# Altium project PCB_Project.PrjPcb (part 3 of 4)

## Sheet Micro.SchDoc
size A4; SheetNumber: 3; SheetTotal: 4
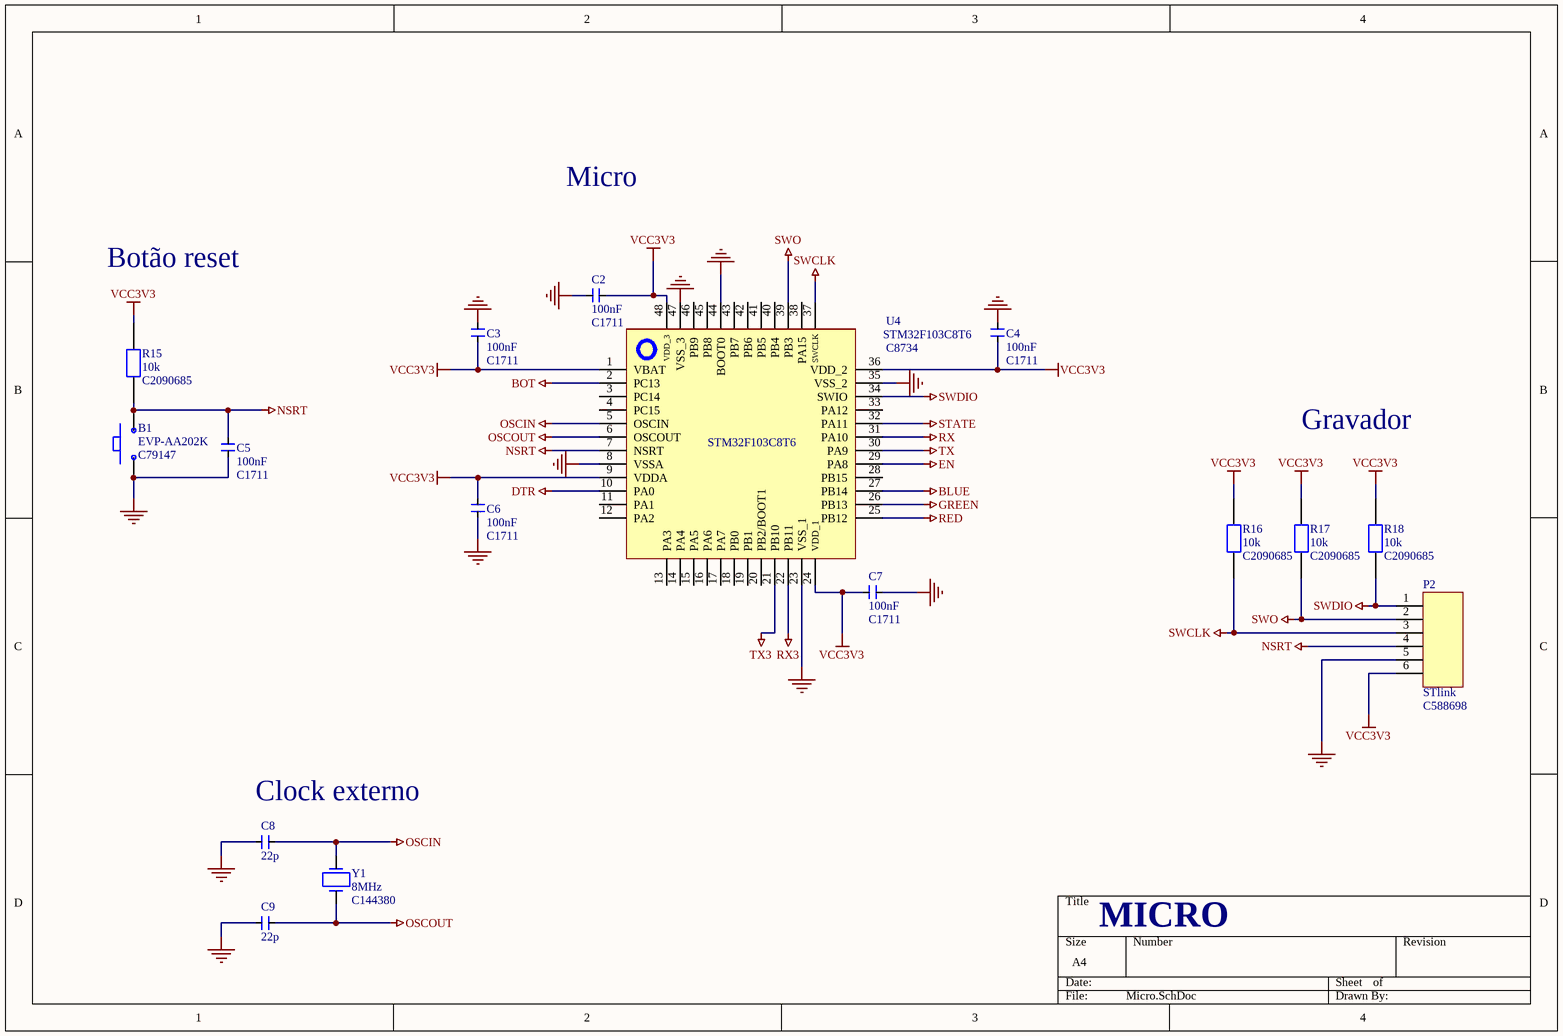
[diagram p2: Micro.SchDoc]

### Parts
B1  EVP-AA202K  LCSC: C79147  [botão]
C2  100nF  LCSC: C1711  [0805_samsung]
C3  100nF  LCSC: C1711  [0805_samsung]
C4  100nF  LCSC: C1711  [0805_samsung]
C5  100nF  LCSC: C1711  [0805_samsung]
C6  100nF  LCSC: C1711  [0805_samsung]
C7  100nF  LCSC: C1711  [0805_samsung]
C8  22p  [22p]
C9  22p  [22p]
P2  STlink  LCSC: C588698  [conector6pinos2linhas]
R15  10k  LCSC: C2090685  [10kResistor]
R16  10k  LCSC: C2090685  [10kResistor]
R17  10k  LCSC: C2090685  [10kResistor]
R18  10k  LCSC: C2090685  [10kResistor]
U4  STM32F103C8T6  LCSC: C8734  [STM32F103C8T6]
Y1  8MHz  LCSC: C144380  [cristal]

### Nets
BLUE: U4.27(PB14)
BOT: U4.2(PC13)
DTR: U4.10(PA0)
EN: U4.29(PA8)
GND: B1.3 C2.1 C3.1 C4.1 C5.2 C6.2 C7.2 C8.1 C9.1 P2.5 U4.8(VSSA) U4.23(VSS_1) U4.35(VSS_2) U4.44(BOOT0) U4.47(VSS_3)
GREEN: U4.26(PB13)
NSRT: B1.1 C5.1 P2.4 R15.1 U4.7(NSRT)
OSCIN: C8.2 U4.5(OSCIN) Y1.1
OSCOUT: C9.2 U4.6(OSCOUT) Y1.2
RED: U4.25(PB12)
RX: U4.31(PA10)
RX3: U4.22(PB11)
STATE: U4.32(PA11)
SWCLK: P2.3 R16.2 U4.37(SWCLK)
SWDIO: P2.1 R18.2 U4.34(SWIO)
SWO: P2.2 R17.2 U4.39(PB3)
TX: U4.30(PA9)
TX3: U4.21(PB10)
VCC3V3: C2.2 C3.2 C4.2 C6.1 C7.1 P2.6 R15.2 R16.1 R17.1 R18.1 U4.1(VBAT) U4.9(VDDA) U4.24(VDD_1) U4.36(VDD_2) U4.48(VDD_3)

Not connected (* = marked no-connect by the designer): U4 3(PC14) 4(PC15) 11(PA1) 12(PA2) 13(PA3) 14(PA4) 15(PA5) 16(PA6) 17(PA7) 18(PB0) 19(PB1) 20(PB2/BOOT1) 28(PB15) 33(PA12) 38(PA15) 40(PB4) 41(PB5) 42(PB6) 43(PB7) 45(PB8) 46(PB9)

### Notes on the sheet
- Micro
- Botão reset
- Gravador
- (near C8) Clock externo
- MICRO

### Library data of the parts
B1 = EVP-AA202K: Switch Tactile N.O. SPST Rectangular Button J-Bend 0.02A 15VDC 1.6N SMD Embossed T/R; Manufacturer: Panasonic; Actuator Length: 300µm; Contact Current Rating: 20mA; Contact Resistance: 100mΩ; Current Rating: 50mA; Electrical Life: 200kcycles; Illumination Type: Illuminated, Non-Illuminated; Max Voltage Rating (DC): 15V; Number of Positions: 1; Switch Function: Off-Mom; Switch Travel: 150µm; Supplier: DigiKey; Supplier Part Number: P13348SCT-ND; Manufacturer Part Number: EVP-AA202K; RoHS: Compliant; Category: Tactile Switches; Stock: 45; Pricing: 1=0,83, 10=0,709, 25=0,6596, 100=0,5885, 250=0,54516, 500=0,51492, 1000=0,48712, 2500=0,45429 (USD); Case/Package: SMD/SMT; Color: Black; Contact Plating: Gold, Silver; Depth: 2.9mm; Height: 1.4mm; Insulation Resistance: 100MΩ; Lead Free: Lead Free; Length: 4.3mm; Lifecycle Status: Production; Max Current Rating: 20mA; Max Operating Temperature: 85°C; Mechanical Life: 200kcycles; Min Operating Temperature: -40°C; Mounting Technology: Surface Mount; Operating Force: 1.6N; Radiation Hardening: No; REACH SVHC: Yes; Termination: J-Bend; Throw Configuration: SPST; Voltage Rating (DC): 15V; ComponentLink1URL: https://datasheet.octopart.com:443/EVP-AA202K-Panasonic-datasheet-156880147.pdf?src-supplier=Newark; ComponentLink1Description: https://datasheet.octopart.com:443/EVP-AA202K-Panasonic-datasheet-156880147.pdf?src-supplier=Newark; ComponentLink2URL: https://datasheet.octopart.com:443/EVP-AA202K-Panasonic-datasheet-78834739.pdf?src-supplier=Newark; ComponentLink2Description: https://datasheet.octopart.com:443/EVP-AA202K-Panasonic-datasheet-78834739.pdf?src-supplier=Newark; ComponentLink3URL: https://datasheet.octopart.com:443/EVP-AA202K-Panasonic-datasheet-13050113.pdf?src-supplier=Upverter; ComponentLink3Description: https://datasheet.octopart.com:443/EVP-AA202K-Panasonic-datasheet-13050113.pdf?src-supplier=Upverter; ComponentLink4URL: https://datasheet.octopart.com:443/EVP-AA202K-Panasonic-datasheet-138897654.pdf?src-supplier=Master+Electronics; ComponentLink4Description: https://datasheet.octopart.com:443/EVP-AA202K-Panasonic-datasheet-138897654.pdf?src-supplier=Master+Electronics; ComponentLink5URL: https://datasheet.octopart.com:443/EVPAA202K-Panasonic-datasheet-130260647.pdf?src-supplier=TME; ComponentLink5Description: https://datasheet.octopart.com:443/EVPAA202K-Panasonic-datasheet-130260647.pdf?src-supplier=TME; ComponentLink6URL: https://datasheet.octopart.com:443/EVP-AA202K-Panasonic-datasheet-94103455.pdf?src-supplier=Future+Electronics; ComponentLink6Description: https://datasheet.octopart.com:443/EVP-AA202K-Panasonic-datasheet-94103455.pdf?src-supplier=Future+Electronics; ComponentLink7URL: https://datasheet.octopart.com:443/EVP-AA202K-Panasonic-datasheet-84052654.pdf?src-supplier=Future+Electronics; ComponentLink7Description: https://datasheet.octopart.com:443/EVP-AA202K-Panasonic-datasheet-84052654.pdf?src-supplier=Future+Electronics; ComponentLink8URL: https://datasheet.octopart.com:443/EVP-AA202K-Panasonic-datasheet-62282203.pdf?src-supplier=Electro+Sonic; ComponentLink8Description: https://datasheet.octopart.com:443/EVP-AA202K-Panasonic-datasheet-62282203.pdf?src-supplier=Electro+Sonic; ComponentLink9URL: https://datasheet.octopart.com:443/EVPAA202K-Panasonic-datasheet-10854221.pdf?src-supplier=Farnell; ComponentLink9Description: https://datasheet.octopart.com:443/EVPAA202K-Panasonic-datasheet-10854221.pdf?src-supplier=Farnell; ComponentLink10URL: https://datasheet.octopart.com:443/EVP-AA202K-Panasonic-datasheet-124616.pdf?src-supplier=DigiKey; ComponentLink10Description: https://datasheet.octopart.com:443/EVP-AA202K-Panasonic-datasheet-124616.pdf?src-supplier=DigiKey
C2-C7 = CL21B104KBCNNNC: Ceramic Capacitor, Multilayer, Ceramic, 50V, 10% +Tol, 10% -Tol, X7R, +-15% TC, 100nF, Surface Mount, 0805 inch; Manufacturer: Samsung Electro-Mechanics; Supplier 1: Avnet; Supplier Part Number 1: CL21B104KBCNNNC; Manufacturer Part Number: CL21B104KBCNNNC; RoHS: Compliant; Category: Ceramic Capacitors; Stock 1: 2653700; Pricing 1: 4000=0,0047, 8000=0,00468, 16000=0,00466, 32000=0,00463, 64000=0,00461 (USD); Capacitance: 100nF; Case/Package: 0805; Case Code (Imperial): 0805; Case Code (Metric): 2012; China RoHS: Compliant; Contact Plating: Tin; Depth: 1.25mm; Dielectric: X7R; Dielectric Material: Ceramic; Height: 950µm; Lead Free: Lead Free; Length: 2mm; Lifecycle Status: Production; Material: Ceramic; Max Operating Temperature: 125°C; Min Operating Temperature: -55°C; Mount: Surface Mount; Number of Terminals: 2; Radiation Hardening: No; REACH SVHC: Yes; Schedule B: 8532240020, 8532240020|8532240020, 8532240020|8532240020|8532240020, 8532240020|8532240020|8532240020|8532240020; Thickness: 939.8µm; Tolerance: 10%; Voltage: 50V; Voltage Rating: 50V; Voltage Rating (DC): 50V; Width: 1.25mm; ComponentLink1URL: https://datasheet.octopart.com:443/CL21B104KBCNNNC-Samsung-Electro-Mechanics-datasheet-137745078.pdf?src-supplier=IHS; ComponentLink1Description: https://datasheet.octopart.com:443/CL21B104KBCNNNC-Samsung-Electro-Mechanics-datasheet-137745078.pdf?src-supplier=IHS; ComponentLink2URL: https://datasheet.octopart.com/CL21B104KBCNNNC-Samsung-Electro-Mechanics-datasheet-8324245.pdf; ComponentLink2Description: https://datasheet.octopart.com/CL21B104KBCNNNC-Samsung-Electro-Mechanics-datasheet-8324245.pdf; ComponentLink3URL: https://datasheet.octopart.com/CL21B104KBCNNNC-Samsung-Electro-Mechanics-datasheet-97040617.pdf; ComponentLink3Description: https://datasheet.octopart.com/CL21B104KBCNNNC-Samsung-Electro-Mechanics-datasheet-97040617.pdf; ComponentLink4URL: https://datasheet.octopart.com:443/CL21B104KBCNNNC-Samsung-Electro-Mechanics-datasheet-11548950.pdf?src-supplier=Future+Electronics; ComponentLink4Description: https://datasheet.octopart.com:443/CL21B104KBCNNNC-Samsung-Electro-Mechanics-datasheet-11548950.pdf?src-supplier=Future+Electronics; ComponentLink5URL: https://datasheet.octopart.com:443/CL21B104KBCNNNC-Samsung-Electro-Mechanics-datasheet-116891032.pdf?src-supplier=Future+Electronics; ComponentLink5Description: https://datasheet.octopart.com:443/CL21B104KBCNNNC-Samsung-Electro-Mechanics-datasheet-116891032.pdf?src-supplier=Future+Electronics; ComponentLink6URL: https://datasheet.octopart.com:443/CL21B104KBCNNNC-Samsung-Electro-Mechanics-datasheet-81462175.pdf?src-supplier=Future+Electronics; ComponentLink6Description: https://datasheet.octopart.com:443/CL21B104KBCNNNC-Samsung-Electro-Mechanics-datasheet-81462175.pdf?src-supplier=Future+Electronics; ComponentLink7URL: https://datasheet.octopart.com:443/CL21B104KBCNNNC-Samsung-datasheet-42485244.pdf?src-supplier=Future+Electronics; ComponentLink7Description: https://datasheet.octopart.com:443/CL21B104KBCNNNC-Samsung-datasheet-42485244.pdf?src-supplier=Future+Electronics; ComponentLink8URL: https://datasheet.octopart.com:443/CL21B104KBCNNNC-Samsung-Electro-Mechanics-datasheet-149045937.pdf?src-supplier=Future+Electronics; ComponentLink8Description: https://datasheet.octopart.com:443/CL21B104KBCNNNC-Samsung-Electro-Mechanics-datasheet-149045937.pdf?src-supplier=Future+Electronics; ComponentLink9URL: https://datasheet.octopart.com:443/CL21B104KBCNNNC-Samsung-datasheet-8326407.pdf?src-supplier=TME; ComponentLink9Description: https://datasheet.octopart.com:443/CL21B104KBCNNNC-Samsung-datasheet-8326407.pdf?src-supplier=TME
C8 C9 = CC0805FRNPO9BN220: 0805 22 pF 50 V ±1 % Tolerance NP0 SMT Multilayer Ceramic Capacitor; Manufacturer: Yageo Group; Value: 22pF; Dielectric: C0G; Tolerance: 1%; Voltage Rating: 50V; Supplier: Newark; Supplier Part Number: CC0805FRNPO9BN220; Manufacturer Part Number: CC0805FRNPO9BN220; RoHS: Compliant; Category: Ceramic Capacitors; Stock: 6538; Pricing: 10=0,099, 25=0,092, 50=0,085, 100=0,078, 250=0,074, 500=0,069, 1000=0,064 (USD); Case/Package: 0805; China RoHS: Compliant; Depth: 1.25mm; Dielectric Material: Ceramic; Halogen Free: Halogen Free; Height: 600µm; Lead Free: Lead Free; Length: 2mm; Lifecycle Status: Production; Max Operating Temperature: 125°C; Min Operating Temperature: -55°C; Mounting Technology: Surface Mount; Number of Terminals: 2; Packaging: Tape and Reel; Radiation Hardening: No; REACH SVHC: Yes; Schedule B: 8532240020, 8532240020|8532240020|8532240020|8532240020|8532240020; Thickness: 711.2µm; Voltage Rating (DC): 50V; Width: 1.25mm; ComponentLink1URL: https://datasheet.octopart.com:443/CC0805FRNPO9BN220-Yageo-datasheet-182140217.pdf?src-supplier=IHS; ComponentLink1Description: https://datasheet.octopart.com:443/CC0805FRNPO9BN220-Yageo-datasheet-182140217.pdf?src-supplier=IHS; ComponentLink2URL: https://datasheet.octopart.com:443/CC0805FRNPO9BN220-Yageo-datasheet-151948684.pdf?src-supplier=element14+APAC; ComponentLink2Description: https://datasheet.octopart.com:443/CC0805FRNPO9BN220-Yageo-datasheet-151948684.pdf?src-supplier=element14+APAC; ComponentLink3URL: https://datasheet.octopart.com:443/CC0805FRNPO9BN220-Yageo-datasheet-181969002.pdf?src-supplier=Farnell; ComponentLink3Description: https://datasheet.octopart.com:443/CC0805FRNPO9BN220-Yageo-datasheet-181969002.pdf?src-supplier=Farnell; ComponentLink4URL: https://datasheet.octopart.com:443/CC0805FRNPO9BN220-Yageo-datasheet-181969001.pdf?src-supplier=Farnell; ComponentLink4Description: https://datasheet.octopart.com:443/CC0805FRNPO9BN220-Yageo-datasheet-181969001.pdf?src-supplier=Farnell; ComponentLink5URL: https://datasheet.octopart.com:443/CC0805FRNPO9BN220-Yageo-datasheet-10406438.pdf?src-supplier=_legacy+Avnet; ComponentLink5Description: https://datasheet.octopart.com:443/CC0805FRNPO9BN220-Yageo-datasheet-10406438.pdf?src-supplier=_legacy+Avnet; ComponentLink6URL: https://datasheet.octopart.com:443/CC0805FRNPO9BN220-Yageo-datasheet-137875056.pdf?src-supplier=Future+Electronics; ComponentLink6Description: https://datasheet.octopart.com:443/CC0805FRNPO9BN220-Yageo-datasheet-137875056.pdf?src-supplier=Future+Electronics; ComponentLink7URL: https://datasheet.octopart.com:443/CC0805FRNPO9BN220-Yageo-datasheet-137700082.pdf?src-supplier=Future+Electronics; ComponentLink7Description: https://datasheet.octopart.com:443/CC0805FRNPO9BN220-Yageo-datasheet-137700082.pdf?src-supplier=Future+Electronics; ComponentLink8URL: https://datasheet.octopart.com:443/CC0805FRNPO9BN220-Yageo-datasheet-78855684.pdf?src-supplier=Future+Electronics; ComponentLink8Description: https://datasheet.octopart.com:443/CC0805FRNPO9BN220-Yageo-datasheet-78855684.pdf?src-supplier=Future+Electronics; ComponentLink9URL: https://datasheet.octopart.com:443/CC0805FRNPO9BN220-Yageo-datasheet-24578986.pdf?src-supplier=Future+Electronics; ComponentLink9Description: https://datasheet.octopart.com:443/CC0805FRNPO9BN220-Yageo-datasheet-24578986.pdf?src-supplier=Future+Electronics; ComponentLink10URL: https://datasheet.octopart.com:443/CC0805FRNPO9BN220-Yageo-datasheet-16730043.pdf?src-supplier=Future+Electronics; ComponentLink10Description: https://datasheet.octopart.com:443/CC0805FRNPO9BN220-Yageo-datasheet-16730043.pdf?src-supplier=Future+Electronics; ComponentLink11URL: https://datasheet.octopart.com:443/CC0805FRNPO9BN220-Yageo-datasheet-12589826.pdf?src-supplier=Future+Electronics; ComponentLink11Description: https://datasheet.octopart.com:443/CC0805FRNPO9BN220-Yageo-datasheet-12589826.pdf?src-supplier=Future+Electronics; ComponentLink12URL: http://sigma.octopart.com:80/conflict_mineral_statement/Yageo-company-3.pdf?src-supplier=Compliance+Statements; ComponentLink12Description: http://sigma.octopart.com:80/conflict_mineral_statement/Yageo-company-3.pdf?src-supplier=Compliance+Statements; ComponentLink13URL: http://sigma.octopart.com:80/rohs_statement/Yageo-company-2.pdf?src-supplier=Compliance+Statements; ComponentLink13Description: http://sigma.octopart.com:80/rohs_statement/Yageo-company-2.pdf?src-supplier=Compliance+Statements
P2 = 90131-0763: Conector STLINK; Manufacturer: Molex; Manufacturer Lifecycle Status: ACTIVE; Contact Resistance: 20mΩ; Current Rating: 3A; Gender: Male; Insulation Resistance: 5GΩ; Number of Circuits: 6; Operating Force: 973mN; Pitch: 2.54mm; Plating: Tin; Plating Thickness: 381nm; Voltage Rating: 350V; Supplier: DigiKey; Supplier Part Number: WM8139-ND; Manufacturer Part Number: 90131-0763; RoHS: Compliant; Category: Headers and Wire Housings; Stock: 9119; Pricing: 1=1,65, 10=1,4, 100=1,1895, 800=1,0271, 1600=0,97808, 5600=0,89539, 10400=0,85718 (USD); China RoHS: Compliant; Contact Gender: Male; Contact Material: Gold, Nickel; Contact Plating: Gold; Country of Origin: SG; Height: 9.65mm; Housing Color: Black; Housing Material: Polyester; Lead Free: Lead Free; Lead Pitch: 2.54mm; Lifecycle Status: Production; Material: Glass, Polyester; Max Operating Temperature: 125°C; Min Operating Temperature: -55°C; Mounting Technology: Through Hole; Number of Contacts: 6; Pins: 6; Number of Poles: 6; Number of Positions: 6; Number of Rows: 2; Orientation: Vertical; Radiation Hardening: No; REACH SVHC: Yes; Row Spacing: 2.54mm; Schedule B: 8536694040, 8536694040|8536694040|8536694040|8536694040|8536694040|8536694040|8536694040|8536694040|8536694040|8536694040|8536694040|8536694040|8536694040|8536694040|8536694040|8536694040|8536694040|8536694040|8536694040|8536694040|8536694040|8536694040|8536694040|85; Terminal Pitch: 2.54mm; Termination: Through Hole; Voltage Rating (AC): 350V; Voltage Rating (DC): 350V; Working Voltage: 350V; ComponentLink1URL: https://datasheet.octopart.com:443/90131-0763-Molex-datasheet-141422385.pdf?src-supplier=IHS; ComponentLink1Description: https://datasheet.octopart.com:443/90131-0763-Molex-datasheet-141422385.pdf?src-supplier=IHS; ComponentLink2URL: https://datasheet.octopart.com:443/90131-0763-Molex-datasheet-13786679.pdf?src-supplier=Sager+Electronics; ComponentLink2Description: https://datasheet.octopart.com:443/90131-0763-Molex-datasheet-13786679.pdf?src-supplier=Sager+Electronics; ComponentLink3URL: https://datasheet.octopart.com:443/0901310763-Molex-datasheet-158267589.pdf?src-supplier=Sager+Electronics; ComponentLink3Description: https://datasheet.octopart.com:443/0901310763-Molex-datasheet-158267589.pdf?src-supplier=Sager+Electronics; ComponentLink4URL: https://datasheet.octopart.com:443/90131-0763-Molex-datasheet-101584004.pdf?src-supplier=element14+APAC; ComponentLink4Description: https://datasheet.octopart.com:443/90131-0763-Molex-datasheet-101584004.pdf?src-supplier=element14+APAC; ComponentLink5URL: https://datasheet.octopart.com:443/90131-0763-Molex-datasheet-154760981.pdf?src-supplier=Master+Electronics; ComponentLink5Description: https://datasheet.octopart.com:443/90131-0763-Molex-datasheet-154760981.pdf?src-supplier=Master+Electronics; ComponentLink6URL: https://datasheet.octopart.com:443/90131-0763-Molex-datasheet-140189868.pdf?src-supplier=RS+(Formerly+Allied+Electronics); ComponentLink6Description: https://datasheet.octopart.com:443/90131-0763-Molex-datasheet-140189868.pdf?src-supplier=RS+(Formerly+Allied+Electronics); ComponentLink7URL: https://datasheet.octopart.com:443/90131-0763-Molex-datasheet-120158967.pdf?src-supplier=RS+(Formerly+Allied+Electronics); ComponentLink7Description: https://datasheet.octopart.com:443/90131-0763-Molex-datasheet-120158967.pdf?src-supplier=RS+(Formerly+Allied+Electronics); ComponentLink8URL: https://datasheet.octopart.com:443/90131-0763-Molex-datasheet-34442414.pdf?src-supplier=RS+(Formerly+Allied+Electronics); ComponentLink8Description: https://datasheet.octopart.com:443/90131-0763-Molex-datasheet-34442414.pdf?src-supplier=RS+(Formerly+Allied+Electronics); ComponentLink9URL: https://datasheet.octopart.com:443/90131-0763-Molex-datasheet-62106567.pdf?src-supplier=Electro+Sonic; ComponentLink9Description: https://datasheet.octopart.com:443/90131-0763-Molex-datasheet-62106567.pdf?src-supplier=Electro+Sonic; ComponentLink10URL: https://datasheet.octopart.com:443/90131-0763-Molex-datasheet-37173065.pdf?src-supplier=Electro+Sonic; ComponentLink10Description: https://datasheet.octopart.com:443/90131-0763-Molex-datasheet-37173065.pdf?src-supplier=Electro+Sonic; ComponentLink11URL: https://datasheet.octopart.com:443/90131-0763-Molex-datasheet-23711474.pdf?src-supplier=Electro+Sonic; ComponentLink11Description: https://datasheet.octopart.com:443/90131-0763-Molex-datasheet-23711474.pdf?src-supplier=Electro+Sonic; ComponentLink12URL: https://datasheet.octopart.com:443/90131-0763-Molex-datasheet-33004657.pdf?src-supplier=Newark; ComponentLink12Description: https://datasheet.octopart.com:443/90131-0763-Molex-datasheet-33004657.pdf?src-supplier=Newark; ComponentLink13URL: https://datasheet.octopart.com:443/90131-0763-Molex-datasheet-13548877.pdf?src-supplier=Farnell; ComponentLink13Description: https://datasheet.octopart.com:443/90131-0763-Molex-datasheet-13548877.pdf?src-supplier=Farnell; ComponentLink14URL: https://datasheet.octopart.com:443/90131-0763-Molex-datasheet-10978908.pdf?src-supplier=Farnell; ComponentLink14Description: https://datasheet.octopart.com:443/90131-0763-Molex-datasheet-10978908.pdf?src-supplier=Farnell; ComponentLink15URL: https://datasheet.octopart.com:443/90131-0763-Molex-datasheet-531206.pdf?src-supplier=Farnell; ComponentLink15Description: https://datasheet.octopart.com:443/90131-0763-Molex-datasheet-531206.pdf?src-supplier=Farnell; ComponentLink16URL: https://datasheet.octopart.com:443/90131-0763-Molex-datasheet-5392624.pdf?src-supplier=Verical; ComponentLink16Description: https://datasheet.octopart.com:443/90131-0763-Molex-datasheet-5392624.pdf?src-supplier=Verical; ComponentLink17URL: https://datasheet.octopart.com:443/90131-0763-Molex-datasheet-124887.pdf?src-supplier=DigiKey; ComponentLink17Description: https://datasheet.octopart.com:443/90131-0763-Molex-datasheet-124887.pdf?src-supplier=DigiKey; ComponentLink18URL: http://sigma.octopart.com:80/conflict_mineral_statement/Molex-company-72.pdf?src-supplier=Compliance+Statements; ComponentLink18Description: http://sigma.octopart.com:80/conflict_mineral_statement/Molex-company-72.pdf?src-supplier=Compliance+Statements; ComponentLink19URL: http://sigma.octopart.com:80/rohs_statement/Molex-company-73.pdf?src-supplier=Compliance+Statements; ComponentLink19Description: http://sigma.octopart.com:80/rohs_statement/Molex-company-73.pdf?src-supplier=Compliance+Statements; ComponentLink20URL: http://sigma.octopart.com:80/reach_statement/Molex-company-74.pdf?src-supplier=Compliance+Statements; ComponentLink20Description: http://sigma.octopart.com:80/reach_statement/Molex-company-74.pdf?src-supplier=Compliance+Statements
R15-R18 = MCU0805MD1002DP500: Fixed Resistor, Thin Film, 0.14W, 10000ohm, 150V, 0.5% +/-Tol, 25ppm/Cel, Surface Mount, 0805; Manufacturer: Vishay; Max Power Dissipation: 200mW; Power Dissipation: 140mW; Value: 10kΩ; Temperature Coefficient: 25ppm/°C; Supplier: DigiKey; Supplier Part Number: MCU0805-10.0K-MDCT-ND; Manufacturer Part Number: MCU0805MD1002DP500; RoHS: Compliant; Category: Chip SMD Resistors; Stock: 19723; Pricing: 1=0,13, 10=0,108, 25=0,1008, 50=0,095, 100=0,0897, 250=0,08332, 500=0,0789, 1000=0,07487 (USD); Case/Package: 0805; Case Code (Imperial): 0805; Case Code (Metric): 2012; China RoHS: Non-Compliant; Composition: Thin Film; Features: Automotive AEC-Q200; Height: 520µm; Length: 2.0066mm; Lifecycle Status: Production; Max Operating Temperature: 125°C; Min Operating Temperature: -55°C; Mounting Technology: Surface Mount; Number of Terminals: 2; Number of Terminations: 2; Packaging: Digi-Reel®; Power Rating: 200mW; REACH SVHC: Yes; Termination: SMD/SMT; Tolerance: 0.5%; Voltage Rating: 150V; Weight: 5.499807mg; Width: 1.25mm; Working Voltage: 150V; ComponentLink1URL: https://datasheet.octopart.com:443/MCU0805MD1002DP500-Vishay-datasheet-182027964.pdf?src-supplier=IHS; ComponentLink1Description: https://datasheet.octopart.com:443/MCU0805MD1002DP500-Vishay-datasheet-182027964.pdf?src-supplier=IHS; ComponentLink2URL: https://datasheet.octopart.com:443/MCU0805MD1002DP500-Vishay-datasheet-81842982.pdf?src-supplier=Upverter; ComponentLink2Description: https://datasheet.octopart.com:443/MCU0805MD1002DP500-Vishay-datasheet-81842982.pdf?src-supplier=Upverter; ComponentLink3URL: https://datasheet.octopart.com:443/MCU0805MD1002DP500-Vishay-datasheet-169971017.pdf?src-supplier=Future+Electronics; ComponentLink3Description: https://datasheet.octopart.com:443/MCU0805MD1002DP500-Vishay-datasheet-169971017.pdf?src-supplier=Future+Electronics; ComponentLink4URL: https://datasheet.octopart.com:443/MCU0805MD1002DP500-Vishay-datasheet-114607041.pdf?src-supplier=Future+Electronics; ComponentLink4Description: https://datasheet.octopart.com:443/MCU0805MD1002DP500-Vishay-datasheet-114607041.pdf?src-supplier=Future+Electronics; ComponentLink5URL: http://sigma.octopart.com:80/rohs_statement/Vishay-company-15.pdf?src-supplier=Compliance+Statements; ComponentLink5Description: http://sigma.octopart.com:80/rohs_statement/Vishay-company-15.pdf?src-supplier=Compliance+Statements
U4 = STM32F103C8T6: MCU 32-bit STM32F1 ARM Cortex M3 RISC 64KB Flash 2.5V/3.3V 48-Pin LQFP Tray; Manufacturer: STMicroelectronics; Manufacturer Package Identifier: ai14911d; ADC Channels (Resolution): 10-Ch 12-Bit; Address Bus Width: 32b; Density: 512kb; EEPROM Memory Size: 0B; Frequency: 72MHz; Interface: CAN, USB; Clock Frequency: 16MHz; Max Power Dissipation: 363mW; Max Supply Current: 50mA; Max Supply Voltage: 3.6V; Min Supply Voltage: 2V; Nominal Supply Current: 1.7µA; Number of A/D Converters: 2; Number of ADC Channels: 10; Number of Bits: 32; Number of I/Os: 37; Number of Interrupts: 16; Number of Programmable I/O: 48; Number of PWM Channels: 1; Number of Timers/Counters: 4; Number of USART Channels: 3; Operating Supply Voltage: 3.3V; Oscillator Type: Internal; Peripherals: POR; RAM Size: 20kB; Watchdog Timer: Yes; Supplier: DigiKey; Supplier Part Number: 497-6063-ND; Manufacturer Part Number: STM32F103C8T6; RoHS: Compliant; Category: Microcontrollers; Stock: 4493; Pricing: 1=6,08, 10=4,662, 25=4,3084, 100=3,9192, 250=3,73372, 500=3,6219, 1000=3,5299, 2500=3,43276 (USD); Case/Package: LQFP; China RoHS: Compliant; Core Architecture: ARM; Data Bus Width: 32b; Flash Memory Size: 64kB; Height: 1.45mm; Height - Seated (Max): 1.6mm; Lead Free: Lead Free; Length: 7mm; Lifecycle Status: Production; Max Operating Temperature: 85°C; Memory Size: 64kB; Memory Format: FLASH; Min Operating Temperature: -40°C; Mounting Technology: Surface Mount; Number of Channels: 10; Number of I2C Channels: 2; Pins: 48; Number of SPI Channels: 2; Number of Terminals: 48; Radiation Hardening: No; REACH SVHC: Yes; Schedule B: 8542310000; Terminal Pitch: 500µm; Termination: SMD/SMT; Width: 7mm; ComponentLink1URL: https://datasheet.octopart.com:443/STM32F103C8T6-STMicroelectronics-datasheet-48026265.pdf?src-supplier=ICpick; ComponentLink1Description: https://datasheet.octopart.com:443/STM32F103C8T6-STMicroelectronics-datasheet-48026265.pdf?src-supplier=ICpick; ComponentLink2URL: https://datasheet.octopart.com:443/STM32F103C8T6-STMicroelectronics-datasheet-10330614.pdf?src-supplier=Newark; ComponentLink2Description: https://datasheet.octopart.com:443/STM32F103C8T6-STMicroelectronics-datasheet-10330614.pdf?src-supplier=Newark; ComponentLink3URL: https://datasheet.octopart.com:443/STM32F103C8T6-STMicroelectronics-datasheet-16839800.pdf?src-supplier=Newark; ComponentLink3Description: https://datasheet.octopart.com:443/STM32F103C8T6-STMicroelectronics-datasheet-16839800.pdf?src-supplier=Newark; ComponentLink4URL: https://datasheet.octopart.com:443/STM32F103C8T6-STMicroelectronics-datasheet-14363502.pdf?src-supplier=Farnell; ComponentLink4Description: https://datasheet.octopart.com:443/STM32F103C8T6-STMicroelectronics-datasheet-14363502.pdf?src-supplier=Farnell; ComponentLink5URL: https://datasheet.octopart.com:443/STM32F103C8T6-STMicroelectronics-datasheet-500013.pdf?src-supplier=Farnell; ComponentLink5Description: https://datasheet.octopart.com:443/STM32F103C8T6-STMicroelectronics-datasheet-500013.pdf?src-supplier=Farnell; ComponentLink6URL: https://datasheet.octopart.com:443/STM32F103C8T6-STMicroelectronics-datasheet-8365036.pdf?src-supplier=Farnell; ComponentLink6Description: https://datasheet.octopart.com:443/STM32F103C8T6-STMicroelectronics-datasheet-8365036.pdf?src-supplier=Farnell; ComponentLink7URL: https://datasheet.octopart.com:443/STM32F103C8T6-STMicroelectronics-datasheet-6396519.pdf?src-supplier=Verical; ComponentLink7Description: https://datasheet.octopart.com:443/STM32F103C8T6-STMicroelectronics-datasheet-6396519.pdf?src-supplier=Verical; ComponentLink8URL: https://datasheet.octopart.com:443/STM32F103C8T6-STMicroelectronics-datasheet-21407612.pdf?src-supplier=element14+APAC; ComponentLink8Description: https://datasheet.octopart.com:443/STM32F103C8T6-STMicroelectronics-datasheet-21407612.pdf?src-supplier=element14+APAC; ComponentLink9URL: https://datasheet.octopart.com:443/STM32F103C8T6-STMicroelectronics-datasheet-8700640.pdf?src-supplier=element14; ComponentLink9Description: https://datasheet.octopart.com:443/STM32F103C8T6-STMicroelectronics-datasheet-8700640.pdf?src-supplier=element14; ComponentLink10URL: https://datasheet.octopart.com:443/STM32F103C8T6-STMicroelectronics-datasheet-177520228.pdf?src-supplier=Burklin+Elektronik; ComponentLink10Description: https://datasheet.octopart.com:443/STM32F103C8T6-STMicroelectronics-datasheet-177520228.pdf?src-supplier=Burklin+Elektronik; ComponentLink11URL: https://datasheet.octopart.com:443/STM32F103C8T6-STMicroelectronics-datasheet-165583531.pdf?src-supplier=SOS+electronic; ComponentLink11Description: https://datasheet.octopart.com:443/STM32F103C8T6-STMicroelectronics-datasheet-165583531.pdf?src-supplier=SOS+electronic; ComponentLink12URL: https://datasheet.octopart.com:443/STM32F103C8T6-STMicroelectronics-datasheet-14106722.pdf?src-supplier=iiiC; ComponentLink12Description: https://datasheet.octopart.com:443/STM32F103C8T6-STMicroelectronics-datasheet-14106722.pdf?src-supplier=iiiC; ComponentLink13URL: https://datasheet.octopart.com:443/STM32F103C8T6-STMicroelectronics-datasheet-17594274.pdf?src-supplier=TME; ComponentLink13Description: https://datasheet.octopart.com:443/STM32F103C8T6-STMicroelectronics-datasheet-17594274.pdf?src-supplier=TME; ComponentLink14URL: https://datasheet.octopart.com:443/STM32F103C8T6-STMicroelectronics-datasheet-148251.pdf?src-supplier=Nu+Horizons; ComponentLink14Description: https://datasheet.octopart.com:443/STM32F103C8T6-STMicroelectronics-datasheet-148251.pdf?src-supplier=Nu+Horizons
Y1 = ABM3-8.000MHZ-D2Y-T: Crystal 8MHz ±20ppm (Tol) ±30ppm (Stability) 18pF FUND 140Ohm 2-Pin Mini-CSMD T/R; Manufacturer: Abracon; ESR (Equivalent Series Resistance): 140Ω; Frequency Tolerance: 0.002%; Supplier: DigiKey; Supplier Part Number: 535-10630-1-ND; Manufacturer Part Number: ABM3-8.000MHZ-D2Y-T; RoHS: Compliant; Category: Crystals; Stock: 32401; Pricing: 1=0,67, 10=0,585, 25=0,5536, 50=0,5306, 100=0,5087, 250=0,48104, 500=0,46114 (USD); Case/Package: CSMD; China RoHS: Non-Compliant; Composition: Ceramic; Depth: 3.2mm; Frequency: 8MHz; Frequency Stability: 30ppm; Height: 1.3mm; Lead Free: Lead Free; Length: 5mm; Lifecycle Status: Production; Load Capacitance: 18pF; Max Operating Temperature: 85°C; Min Operating Temperature: -40°C; Mounting Technology: Surface Mount; Pins: 2; Packaging: Cut Tape; Radiation Hardening: No; REACH SVHC: Yes; Schedule B: 8541600025, 8541600025|8541600025|8541600025|8541600025|8541600025|8541600025|8541600025|8541600025|8541600025|8541600025|8541600025|8541600025|8541600025|8541600025|8541600025|8541600025|8541600025|8541600025|8541600025|8541600025|8541600025|8541600025|8541600025|85; ESR: 140Ω; Termination: SMD/SMT; Tolerance: 0.002%; Width: 3.2mm; ComponentLink1URL: https://datasheet.octopart.com:443/ABM3-8.000MHZ-D2Y-T-Abracon-datasheet-182205007.pdf?src-supplier=TME; ComponentLink1Description: https://datasheet.octopart.com:443/ABM3-8.000MHZ-D2Y-T-Abracon-datasheet-182205007.pdf?src-supplier=TME; ComponentLink2URL: https://datasheet.octopart.com:443/ABM3-8.000MHZ-D2Y-T-Abracon-datasheet-32780515.pdf?src-supplier=element14+APAC; ComponentLink2Description: https://datasheet.octopart.com:443/ABM3-8.000MHZ-D2Y-T-Abracon-datasheet-32780515.pdf?src-supplier=element14+APAC; ComponentLink3URL: https://datasheet.octopart.com:443/ABM3-8.000MHZ-D2Y-T-Abracon-datasheet-13417521.pdf?src-supplier=element14+APAC; ComponentLink3Description: https://datasheet.octopart.com:443/ABM3-8.000MHZ-D2Y-T-Abracon-datasheet-13417521.pdf?src-supplier=element14+APAC; ComponentLink4URL: https://datasheet.octopart.com:443/ABM3-8.000MHZ-D2Y-T-Abracon-datasheet-8862594.pdf?src-supplier=element14+APAC; ComponentLink4Description: https://datasheet.octopart.com:443/ABM3-8.000MHZ-D2Y-T-Abracon-datasheet-8862594.pdf?src-supplier=element14+APAC; ComponentLink5URL: https://datasheet.octopart.com:443/ABM3-8.000MHZ-D2Y-T-Abracon-datasheet-8853172.pdf?src-supplier=element14+APAC; ComponentLink5Description: https://datasheet.octopart.com:443/ABM3-8.000MHZ-D2Y-T-Abracon-datasheet-8853172.pdf?src-supplier=element14+APAC; ComponentLink6URL: https://datasheet.octopart.com:443/ABM3-8.000MHZ-D2Y-T-Abracon-datasheet-8835795.pdf?src-supplier=element14+APAC; ComponentLink6Description: https://datasheet.octopart.com:443/ABM3-8.000MHZ-D2Y-T-Abracon-datasheet-8835795.pdf?src-supplier=element14+APAC; ComponentLink7URL: https://datasheet.octopart.com:443/ABM3-8.000MHZ-D2Y-T-Abracon-datasheet-8815637.pdf?src-supplier=element14+APAC; ComponentLink7Description: https://datasheet.octopart.com:443/ABM3-8.000MHZ-D2Y-T-Abracon-datasheet-8815637.pdf?src-supplier=element14+APAC; ComponentLink8URL: https://datasheet.octopart.com:443/ABM3-8.000MHZ-D2Y-T-Abracon-datasheet-8808528.pdf?src-supplier=element14+APAC; ComponentLink8Description: https://datasheet.octopart.com:443/ABM3-8.000MHZ-D2Y-T-Abracon-datasheet-8808528.pdf?src-supplier=element14+APAC; ComponentLink9URL: https://datasheet.octopart.com:443/ABM3-8.000MHZ-D2Y-T-Abracon-datasheet-8488864.pdf?src-supplier=element14+APAC; ComponentLink9Description: https://datasheet.octopart.com:443/ABM3-8.000MHZ-D2Y-T-Abracon-datasheet-8488864.pdf?src-supplier=element14+APAC; ComponentLink10URL: https://datasheet.octopart.com:443/ABM3-8.000MHZ-D2Y-T-Abracon-datasheet-8324950.pdf?src-supplier=element14+APAC; ComponentLink10Description: https://datasheet.octopart.com:443/ABM3-8.000MHZ-D2Y-T-Abracon-datasheet-8324950.pdf?src-supplier=element14+APAC; ComponentLink11URL: https://datasheet.octopart.com:443/ABM3-8.000MHZ-D2Y-T-Abracon-datasheet-577709.pdf?src-supplier=element14+APAC; ComponentLink11Description: https://datasheet.octopart.com:443/ABM3-8.000MHZ-D2Y-T-Abracon-datasheet-577709.pdf?src-supplier=element14+APAC; ComponentLink12URL: https://datasheet.octopart.com:443/ABM3-8.000MHZ-D2Y-T-Abracon-datasheet-154724144.pdf?src-supplier=Sager+Electronics; ComponentLink12Description: https://datasheet.octopart.com:443/ABM3-8.000MHZ-D2Y-T-Abracon-datasheet-154724144.pdf?src-supplier=Sager+Electronics; ComponentLink13URL: https://datasheet.octopart.com:443/ABM3-8.000MHZ-D2Y-T-Abracon-datasheet-128558659.pdf?src-supplier=X-ON; ComponentLink13Description: https://datasheet.octopart.com:443/ABM3-8.000MHZ-D2Y-T-Abracon-datasheet-128558659.pdf?src-supplier=X-ON; ComponentLink14URL: https://sigma.octopart.com:443/138895675/technical_drawing/Abracon-ABM3-8.000MHZ-D2Y-T.pdf?src-supplier=Abracon+SCT; ComponentLink14Description: https://sigma.octopart.com:443/138895675/technical_drawing/Abracon-ABM3-8.000MHZ-D2Y-T.pdf?src-supplier=Abracon+SCT; ComponentLink15URL: https://datasheet.octopart.com:443/ABM3-8.000MHZ-D2Y-T-Abracon-datasheet-12514944.pdf?src-supplier=Farnell; ComponentLink15Description: https://datasheet.octopart.com:443/ABM3-8.000MHZ-D2Y-T-Abracon-datasheet-12514944.pdf?src-supplier=Farnell; ComponentLink16URL: http://sigma.octopart.com:80/conflict_mineral_statement/Abracon-company-27.pdf?src-supplier=Compliance+Statements; ComponentLink16Description: http://sigma.octopart.com:80/conflict_mineral_statement/Abracon-company-27.pdf?src-supplier=Compliance+Statements